# EAGLE design dev_A (EAGLE 9.5.1)
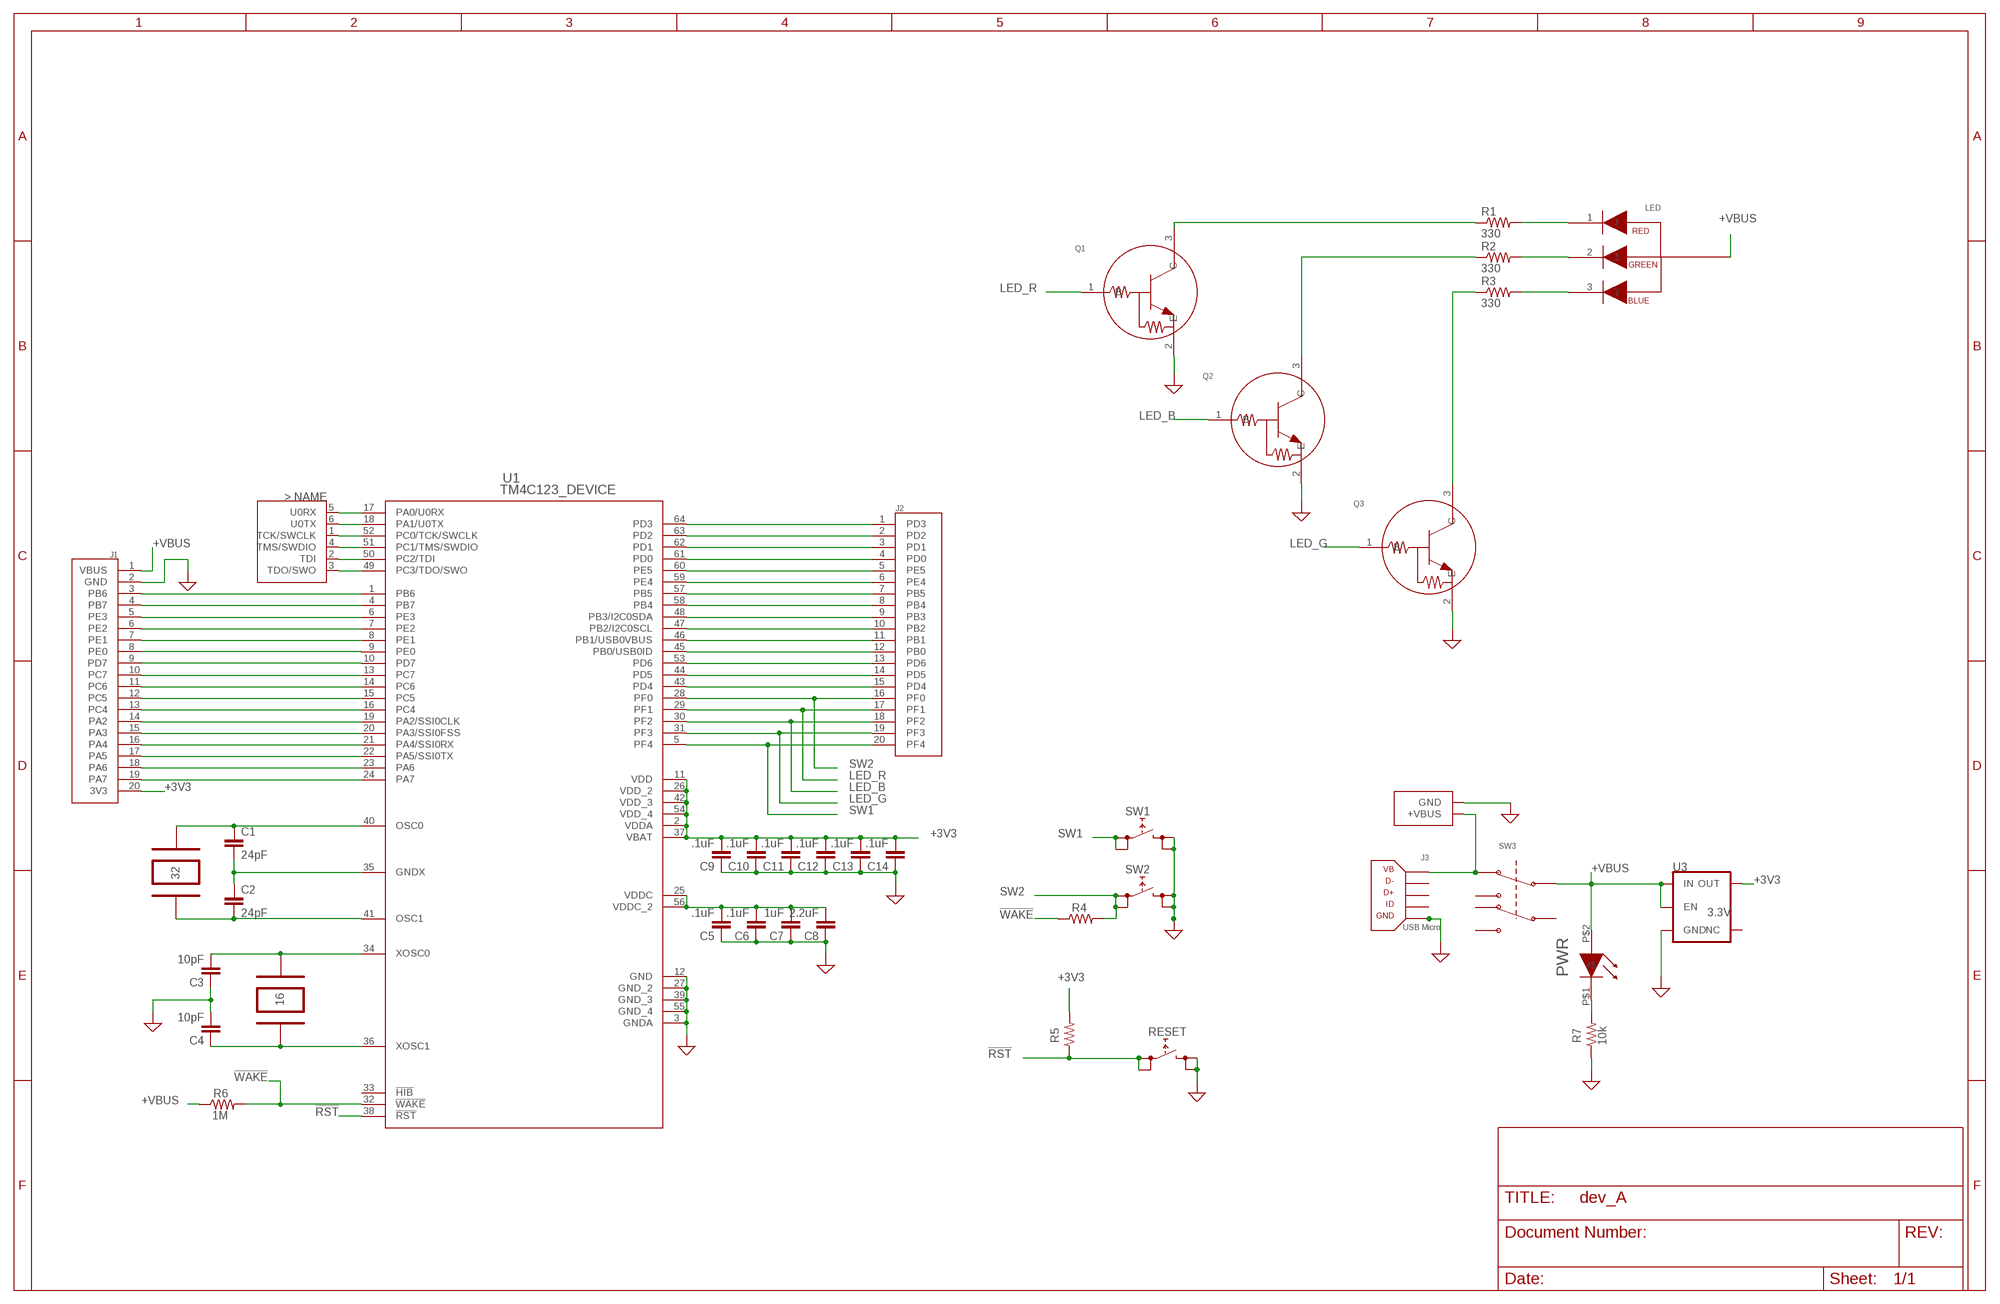
[diagram p0: schematic, sheet 1]

## Parts
C1  24pF  CAPACITOR  [CAPC1005X35N]
C2  24pF  CAPACITOR  [CAPC1005X35N]
C3  10pF  CAPACITOR  [CAPC1005X35N]
C4  10pF  CAPACITOR  [CAPC1005X35N]
C5  .1uF  CAPACITOR  [CAPC1005X35N]
C6  .1uF  CAPACITOR  [CAPC1005X35N]
C7  1uF  CAPACITOR  [CAPC1005X35N]
C8  2.2uF  CAPACITOR  [CAPC1005X35N]
C9  .1uF  CAPACITOR  [CAPC1005X35N]
C10  .1uF  CAPACITOR  [CAPC1005X35N]
C11  .1uF  CAPACITOR  [CAPC1005X35N]
C12  .1uF  CAPACITOR  [CAPC1005X35N]
C13  .1uF  CAPACITOR  [CAPC1005X35N]
C14  .1uF  CAPACITOR  [CAPC1005X35N]
DEBUG  JTAG  [HDRV6W64P254_2X3_800X508X838B]
J1  HEADER_J1  [HDRV20W80P254_1X20_5100X250X838B]
J2  HEADER_J2  [HDRV20W80P254_1X20_5100X250X838B]
J3  USBMICRO  [USBMICROB]
LED  RGBLED  [RGBLED]
PWR  LED_511  [LED_511]
Q1  NPN_BJT  [SOT416]
Q2  NPN_BJT  [SOT416]
Q3  NPN_BJT  [SOT416]
R1  330  RESISTOR  [CAPC1005X35N]
R2  330  RESISTOR  [CAPC1005X35N]
R3  330  RESISTOR  [CAPC1005X35N]
R4  RESISTOR  [CAPC1005X35N]
R5  RESISTOR  [CAPC1005X35N]
R6  1M  RESISTOR  [CAPC1005X35N]
R7  10k  RESISTOR  [CAPC1005X35N]
RESET  SWITCH_B3S  [SW_BS3]
SW1  SWITCH_B3S  [SW_BS3]
SW2  SWITCH_B3S  [SW_BS3]
SW3  JS202011SCQN  [SW_JS202011SCQN]
U1  TM4C123_DEVICE  [TM3C123_FOOTPRINT]
U3  3.3V  V_REG_AP2112K-3.3V  [SOT23-5]
VBUS  POWER  [HDRV2W64P254_1X2_600X300X838B]
Y1  32kHz  32KHZ_OSCILATOR  [GHI2_CRYSTAL_3.2X1.5]
Y2  Y2  16MHZ_OSCILLATOR  [CRYSTAL_16MHZ]

## Nets
!RST: R5.1 RESET.1 RESET.2 U1.38(!RST)
!WAKE: R4.1 R6.2 U1.32(!WAKE)
+3V3: C9.2 C10.2 C11.2 C12.2 C13.2 C14.2 J1.20(3V3) R5.2 U1.2(VDDA) U1.11(VDD) U1.26(VDD_2) U1.37(VBAT) U1.42(VDD_3) U1.54(VDD_4) U3.5(OUT)
+VBUS: J1.1(VBUS) LED.4 PWR.P$2 R6.1 SW3.2 U3.1(IN) U3.3(EN)
+VBUS_IN: J3.VB SW3.1 VBUS.1(+VBUS)
GND: C3.1 C4.2 C5.1 C6.1 C7.1 C8.1 C9.1 C10.1 C11.1 C12.1 C13.1 C14.1 J1.2(GND) J3.0(GND) J3.01(GND) J3.02(GND) J3.03(GND) J3.GND Q1.2(E) Q2.2(E) Q3.2(E) R7.1 RESET.3 RESET.4 SW1.3 SW1.4 SW2.3 SW2.4 U1.3(GNDA) U1.12(GND) U1.27(GND_2) U1.39(GND_3) U1.55(GND_4) U3.2(GND) VBUS.2(GND) ; supply symbol labelled SUP
LED_B: J2.18(PF2) Q2.1(B) U1.30(PF2)
LED_G: J2.19(PF3) Q3.1(B) U1.31(PF3)
LED_R: J2.17(PF1) Q1.1(B) U1.29(PF1)
N$3: J1.5(PE3) U1.6(PE3)
N$4: J1.6(PE2) U1.7(PE2)
N$5: J1.7(PE1) U1.8(PE1)
N$6: J1.8(PE0) U1.9(PE0)
N$7: J1.9(PD7) U1.10(PD7)
N$8: J1.10(PC7) U1.13(PC7)
N$9: J1.11(PC6) U1.14(PC6)
N$10: J1.12(PC5) U1.15(PC5)
N$11: J1.13(PC4) U1.16(PC4)
N$12: J1.14(PA2) U1.19(PA2/SSI0CLK)
N$13: J1.15(PA3) U1.20(PA3/SSI0FSS)
N$14: J1.16(PA4) U1.21(PA4/SSI0RX)
N$15: J1.17(PA5) U1.22(PA5/SSI0TX)
N$16: J1.18(PA6) U1.23(PA6)
N$17: J1.19(PA7) U1.24(PA7)
N$18: J2.15(PD4) U1.43(PD4)
N$19: J2.14(PD5) U1.44(PD5)
N$20: J2.13(PD6) U1.53(PD6)
N$21: J2.12(PB0) U1.45(PB0/USB0ID)
N$22: J2.11(PB1) U1.46(PB1/USB0VBUS)
N$23: J2.10(PB2) U1.47(PB2/I2C0SCL)
N$24: J2.9(PB3) U1.48(PB3/I2C0SDA)
N$25: J2.8(PB4) U1.58(PB4)
N$26: J2.7(PB5) U1.57(PB5)
N$27: J2.6(PE4) U1.59(PE4)
N$28: J2.5(PE5) U1.60(PE5)
N$29: J2.4(PD0) U1.61(PD0)
N$30: J2.3(PD1) U1.62(PD1)
N$31: PWR.P$1 R7.2
N$32: LED.1 R1.2
N$33: LED.2 R2.2
N$34: LED.3 R3.2
N$35: Q3.3(C) R3.1
N$36: Q2.3(C) R2.1
N$37: Q1.3(C) R1.1
N$38: C1.1 U1.40(OSC0) Y1.P$2
N$39: C2.2 U1.41(OSC1) Y1.P$1
N$40: C1.2 C2.1 U1.35(GNDX)
N$41: C3.2 U1.34(XOSC0) Y2.2
N$42: C4.1 U1.36(XOSC1) Y2.1
N$43: DEBUG.5(U0RX) U1.17(PA0/U0RX)
N$45: DEBUG.6(U0TX) U1.18(PA1/U0TX)
N$46: DEBUG.1(TCK/SWCLK) U1.52(PC0/TCK/SWCLK)
N$47: DEBUG.4(TMS/SWDIO) U1.51(PC1/TMS/SWDIO)
N$48: DEBUG.2(TDI) U1.50(PC2/TDI)
N$49: DEBUG.3(TDO/SWO) U1.49(PC3/TDO/SWO)
N$50: J2.2(PD2) U1.63(PD2)
N$51: J2.1(PD3) U1.64(PD3)
PB6: J1.3(PB6) U1.1(PB6)
PB7: J1.4(PB7) U1.4(PB7)
SW1: J2.20(PF4) SW1.1 SW1.2 U1.5(PF4)
SW2: J2.16(PF0) R4.2 SW2.1 SW2.2 U1.28(PF0)
VDDC: C5.2 C6.2 C7.2 C8.2 U1.25(VDDC) U1.56(VDDC_2)
Unconnected: J3.D+ J3.D- J3.ID SW3.3 SW3.4 SW3.5 SW3.6 U1.33(!HIB) U3.4(NC)

## Library data of the parts
C1-C14 = MICROCONTROLLER:CAPACITOR
DEBUG = MICROCONTROLLER:JTAG
J1 = MICROCONTROLLER:HEADER_J1
J2 = MICROCONTROLLER:HEADER_J2
J3 = MICROCONTROLLER:USBMICRO
LED = MICROCONTROLLER:RGBLED
PWR = MICROCONTROLLER:LED_511
Q1-Q3 = MICROCONTROLLER:NPN_BJT
R1-R7 = MICROCONTROLLER:RESISTOR
RESET SW1 SW2 = MICROCONTROLLER:SWITCH_B3S
SW3 = MICROCONTROLLER:JS202011SCQN; MANUFACTURER_PART_NUMBER: JS202011SCQN; VENDOR: C&K
U1 = MICROCONTROLLER:TM4C123_DEVICE
U3 = SparkFun-IC-Power:V_REG_AP2112: AP2112 - 600mA CMOS LDO Regulator w/ Enable The AP2112 is CMOS process low dropout linear regulator with enable function, the regulator delivers a guaranteed 600mA (min.) continuous load current. Features Output Voltage Accuracy: ±1.5% Output Current: 600mA (Min.) Foldback Short Current Protection: 50mA Enable Function to Turn ON/OFF VOUT Low Dropout Voltage (3.3V): 250mV (Typ.) @IOUT=600mA Excellent Load Regulation: 0.2%/A (Typ.) Excellent Line Regulation: 0.02%/V (Typ.) Low Quiescent Current: 55μA (Typ.) Low Standby Current: 0.01μA (Typ.) Low Output Noise: 50μVRMS PSRR: 100Hz -65dB, 1kHz -65dB OTSD Protection Stable with 1.0μF Flexible Cap: Ceramic, Tantalum and Aluminum Electrolytic Operation Temperature Range: -40°C to 85°C ESD: MM 400V, HBM 4000V; PROD_ID: VREG-12457
VBUS = MICROCONTROLLER:POWER
Y1 = MICROCONTROLLER:32KHZ_OSCILATOR
Y2 = MICROCONTROLLER:16MHZ_OSCILLATOR

## Board
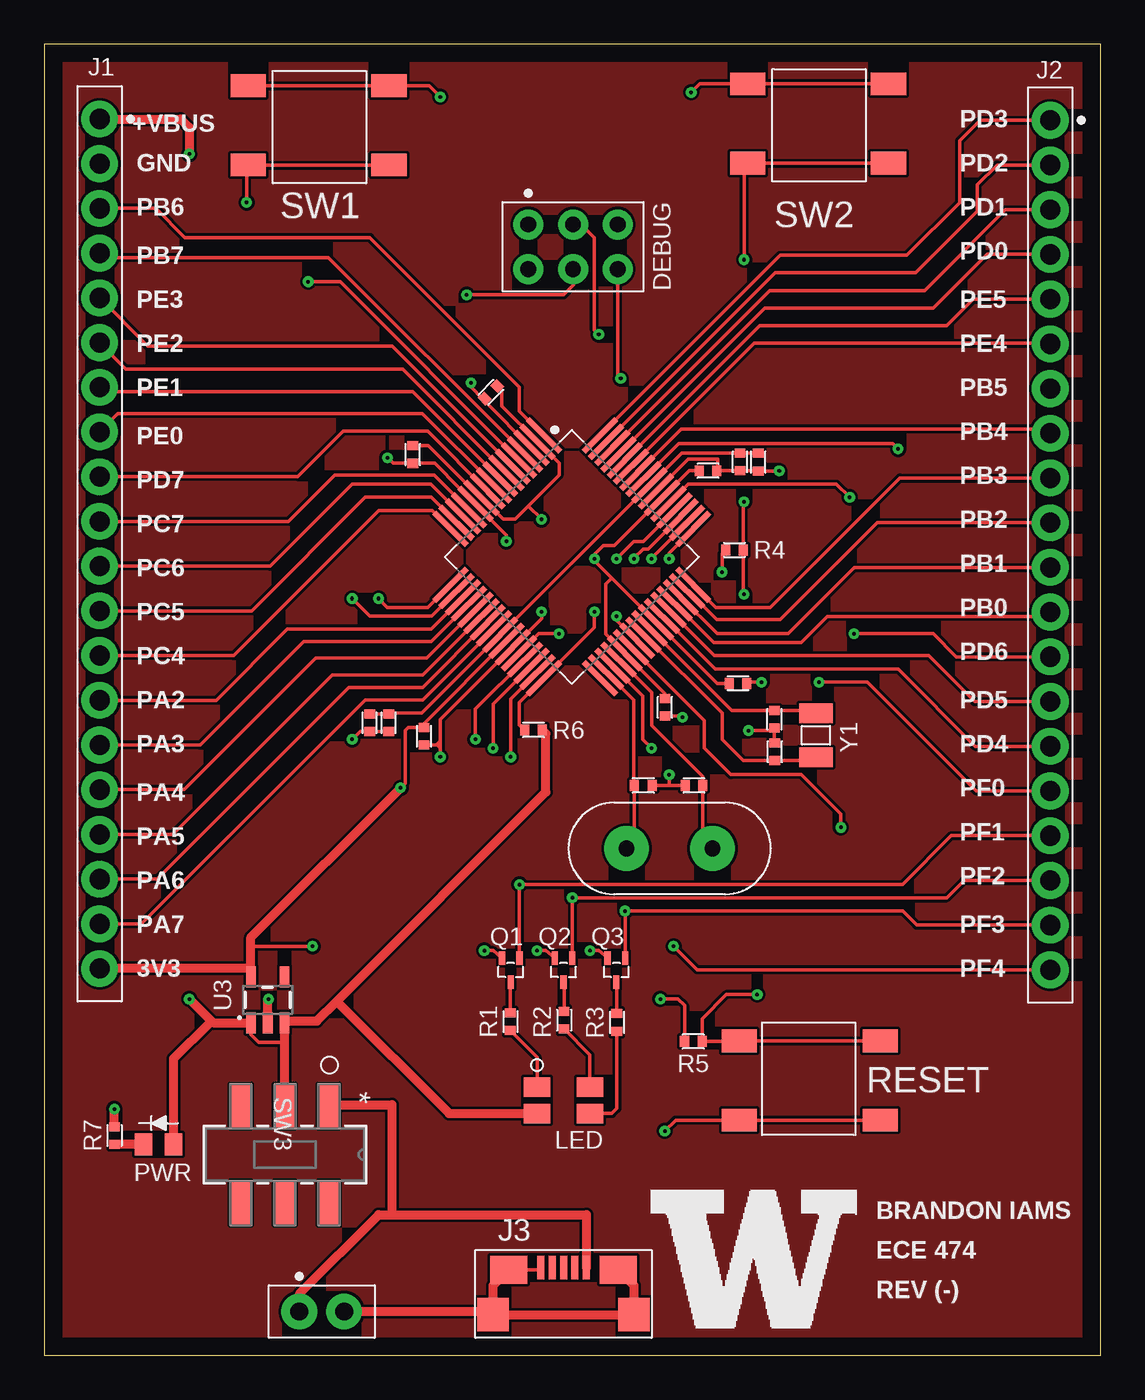
[diagram p1: board, top side]
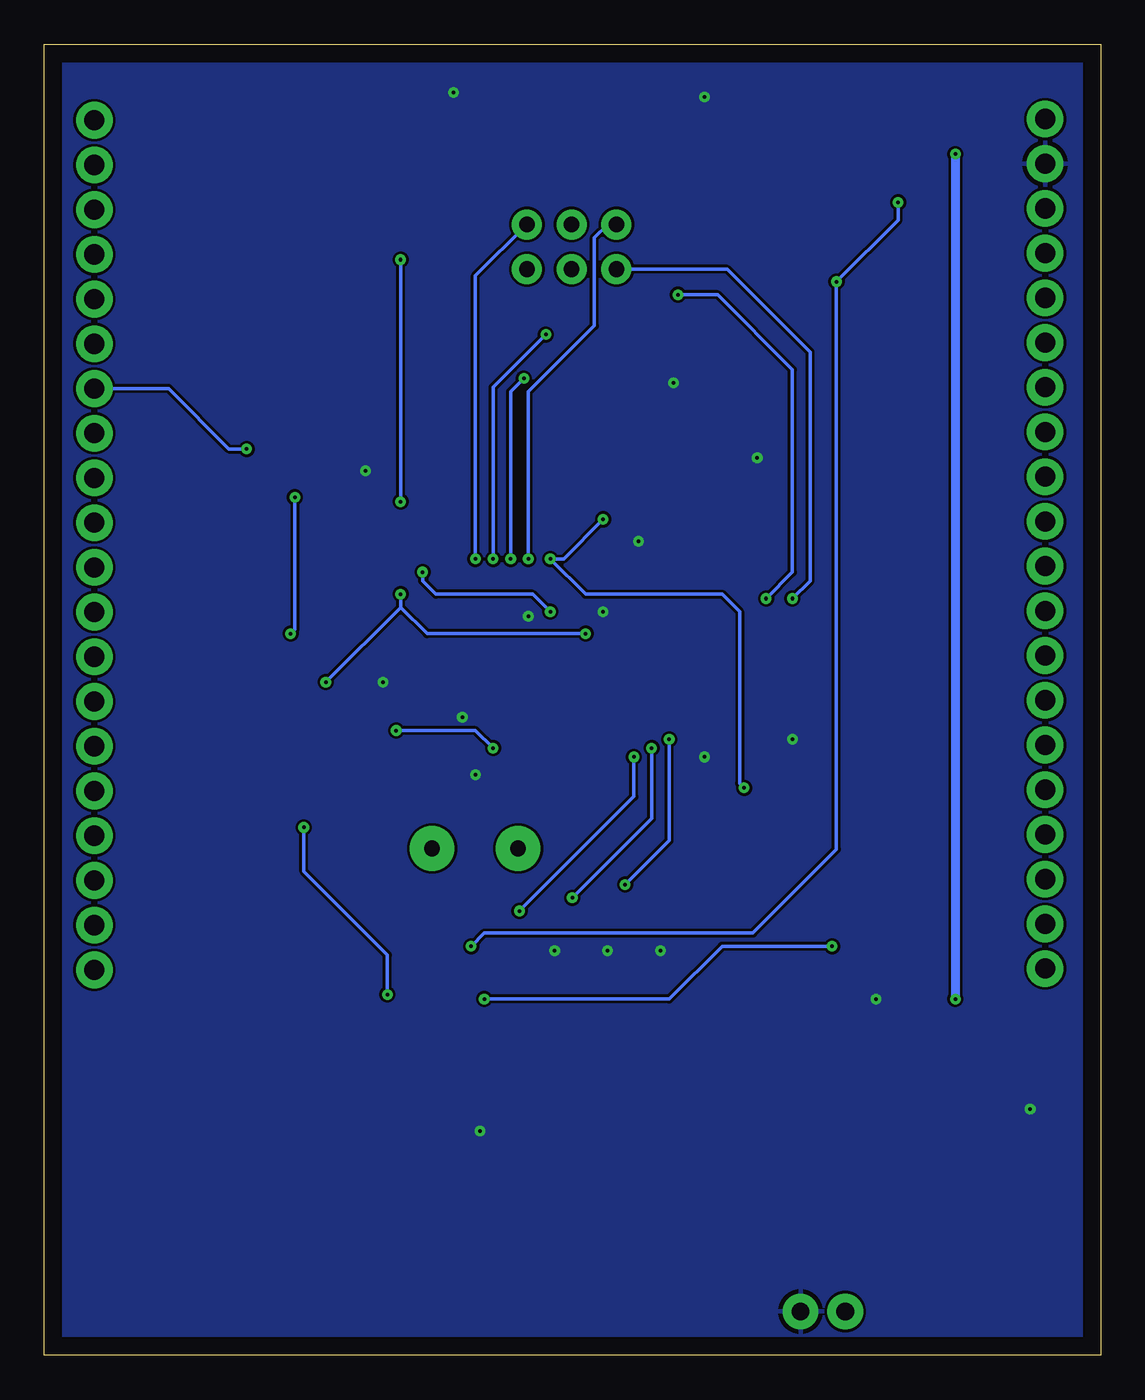
[diagram p2: board, bottom side, seen from below]

Size 60 x 74.5 mm. Coordinates in mm from the lower left corner, seen from the top.
Outline: 0,0 60,0 60,74.5 0,74.5 0,0
Copper layers (1*16): Top 0.035mm / dielectric 1.5mm / Bottom 0.035mm
Design rules "default *": minimum track width 3.5mil, minimum drill 0.2mm, track to track 6mil, track to pad 6mil, pad to pad 6mil, via to via 6mil, smd to smd 6mil, copper to edge 40mil, drill to drill 6mil, minimum pad ring 10mil, minimum via ring 8mil, stop-mask expansion 4mil, vias tented up to drill 0.21mm, thermal gap 10mil

### Footprints (pad centres in the part's own frame; a part is rotated, then mirrored left to right if it is on the bottom)
CAPC1005X35N = smd 0.512 x 0.612: 1 -0.5,0; 2 0.5,0
HDRV6W64P254_2X3_800X508X838B = drill 0.889 pad 1.705: 1 0,0; 2 2.54,0; 3 5.08,0; 4 5.08,-2.54; 5 2.54,-2.54; 6 0,-2.54
HDRV20W80P254_1X20_5100X250X838B = drill 1.143 pad 2.083: 1 0,0; 2 2.54,0; 3 5.08,0; 4 7.62,0; 5 10.16,0; 6 12.7,0; 7 15.24,0; 8 17.78,0; 9 20.32,0; 10 22.86,0; 11 25.4,0; 12 27.94,0; 13 30.48,0; 14 33.02,0; 15 35.56,0; 16 38.1,0; 17 40.64,0; 18 43.18,0; 19 45.72,0; 20 48.26,0
USBMICROB = smd 1.8 x 1.9: 0 -4,-2.675; 03 4,-2.675 | smd 2.1 x 1.6: 01 -3.1,-0.125; 02 3.1,-0.125 | smd 0.4 x 1.35: D+ 0,0; D- 0.65,0; GND -1.3,0; ID -0.65,0; VB 1.3,0
RGBLED = smd 1.1 x 1.5: 1 -0.75,-1.5; 2 -0.75,1.5; 3 0.75,1.5; 4 0.75,-1.5
LED_511 = smd 1 x 1.25: P$1 -0.85,0; P$2 0.85,0
SOT416 = smd 0.356 x 0.762: 1 0,-0.076; 2 1,-0.076; 3 0.5,1.295
SW_BS3 = smd 2 x 1.3: 1 4,-2.25; 2 -4,-2.25; 3 4,2.25; 4 -4,2.25
SW_JS202011SCQN = smd 2.489 x 1.194: 1 -2.756,2.5; 2 -2.756,0; 3 -2.756,-2.5; 4 2.756,-2.5; 5 2.756,0; 6 2.756,2.5
TM3C123_FOOTPRINT = smd 2.6 x 0.322: 1 -6,3.75; 2 -6,3.25; 3 -6,2.75; 4 -6,2.25; 5 -6,1.75; 6 -6,1.25; 7 -6,0.75; 8 -6,0.25; 9 -6,-0.25; 10 -6,-0.75; 11 -6,-1.25; 12 -6,-1.75; 13 -6,-2.25; 14 -6,-2.75; 15 -6,-3.25; 16 -6,-3.75; 33 6,-3.75; 34 6,-3.25; 35 6,-2.75; 36 6,-2.25; 37 6,-1.75; 38 6,-1.25; 39 6,-0.75; 40 6,-0.25; 41 6,0.25; 42 6,0.75; 43 6,1.25; 44 6,1.75; 45 6,2.25; 46 6,2.75; 47 6,3.25; 48 6,3.75 | smd 0.322 x 2.6: 17 -3.75,-6; 18 -3.25,-6; 19 -2.75,-6; 20 -2.25,-6; 21 -1.75,-6; 22 -1.25,-6; 23 -0.75,-6; 24 -0.25,-6; 25 0.25,-6; 26 0.75,-6; 27 1.25,-6; 28 1.75,-6; 29 2.25,-6; 30 2.75,-6; 31 3.25,-6; 32 3.75,-6; 49 3.75,6; 50 3.25,6; 51 2.75,6; 52 2.25,6; 53 1.75,6; 54 1.25,6; 55 0.75,6; 56 0.25,6; 57 -0.25,6; 58 -0.75,6; 59 -1.25,6; 60 -1.75,6; 61 -2.25,6; 62 -2.75,6; 63 -3.25,6; 64 -3.75,6
SOT23-5 = smd 0.55 x 1.2: 1 -0.95,-1.3; 2 0,-1.3; 3 0.95,-1.3; 4 0.95,1.3; 5 -0.95,1.3
HDRV2W64P254_1X2_600X300X838B = drill 1.016 pad 2.032: 1 0,0; 2 2.54,0
GHI2_CRYSTAL_3.2X1.5 = smd 1.1 x 1.9: P$1 -1.25,0; P$2 1.25,0
CRYSTAL_16MHZ = drill 0.889 pad 2.54: 1 -2.44,0; 2 2.44,0

### Placement (x,y rotation side)
C1  41.5,34.3 90 top
C2  41.48,36.15 90 top
C3  34.03,32.38 180 top
C4  36.91,32.38 180 top
C5  18.49,35.95 90 top
C6  39.52,50.76 90 top
C7  19.57,35.95 90 top
C8  40.56,50.75 90 top
C9  37.71,50.26 180 top
C10  39.4,38.18 180 top
C11  21.58,35.18 90 top
C12  20.94,51.18 90 top
C13  35.26,36.82 90 top
C14  25.38,54.72 45 top
DEBUG  27.5,64.25 0 top
J1  3.15,70.24 270 top
J2  57.14,70.17 270 top
J3  29.5,5 0 top
LED  29.5,14.5 270 top
PWR  6.5,12 0 top
Q1  27,22.5 180 top
Q2  30,22.5 180 top
Q3  33,22.5 180 top
R1  26.48,18.96 270 top
R2  29.53,19.04 270 top
R3  32.53,18.92 270 top
R4  39.21,45.76 0 top
R5  36.87,17.84 180 top
R6  27.79,35.53 180 top
R7  4,12.5 270 top
RESET  43.48,15.62 180 top
SW1  15.59,69.88 0 top
SW2  43.96,69.98 0 top
SW3  13.68,11.41 270 top
U1  29.97,45.37 315 top
U3  12.7,20.2 0 top
U$1  LOGO  [LOGO]  34.5,1 0 top
VBUS  14.5,2.5 0 top
Y1  43.83,35.24 270 top
Y2  35.52,28.8 180 top

### Tracks (layer width: path | path; a pad name or v marks a point on that pad's centre or on a via)
!RST  (via drill 0.2)
  Top 0.2: U1.38 37.5,36.07 37.5,34.5 39,33 43,33 45.25,30.75 v45.25,30 | v40.5,20.5 38.75,20.5 37.37,19.12 R5.1 39.48,17.84 RESET.1 | RESET.1 RESET.2 | RESET.1 39.85,17.5
  Bottom 0.2: v40.5,20.5 40.5,22.75 45.25,27.5 v45.25,30
!WAKE  (via drill 0.2)
  Top 0.2: R6.2 27,35.82 27,37.09 U1.32 31.25,41.34 v31.25,42.25 | v38.5,44.5 38.5,45.55 R4.1
  Bottom 0.2: v31.25,42.25 32.25,43.25 37.75,43.25 38.5,44 v38.5,44.5
+3V3  (via drill 0.2)
  Top 0.2: U1.26 21.58,35.91 C11.2 20.68,35.68 20.5,35.5 20.5,32.5 v20.25,32.25 | C13.2 35.26,37.6 U1.37 31.89,40.98 31.89,43.83 32.23,44.17 | C14.2 26,54.81 26,53.94 U1.2 29.25,50.69 29.25,50 27.5,48.25 | U3.5 11.75,22 | C12.2 21.82,51.68 23.79,49.71 23.81,49.71 24.79,48.73 U1.11 26.07,47.5 26.75,47.5 27.5,48.25 | C10.2 38.22,38.18 U1.42 32.23,44.17 | v15.25,23.25 11.75,23.25 | v35,20.25 36,20.25 36.37,19.88 R5.2 | C9.2 36.63,50.26 U1.54 32.37,46 31.75,46 31.25,45.5 v31.25,45.25 31.25,45.15 32.23,44.17 | v28.25,47.5 27.5,48.25
  Top 0.5: 11.75,22 3.17,22 J1.20 | U3.5 11.75,23.25 11.75,23.75 v20.25,32.25
  Bottom 0.2: v15.25,23.25 21.5,23.25 24.5,20.25 v35,20.25 | v28.25,47.5 30.5,45.25 v31.25,45.25 29.25,43.25 21.5,43.25 20.5,42.25 20.5,32.5 v20.25,32.25
+VBUS  (via drill 0.2)
  Top 0.2: 13.65,17.8 U3.3 13.75,19 | 13.65,17.8 13.65,15.95 | 13.65,17.8 12.2,17.8 11.75,18.25 U3.1 9.4,18.9
  Top 0.5: PWR.P$2 7.35,16.85 9.4,18.9 | R6.1 28.5,35.32 28.5,32 16.62,20.12 | 13.75,19 15.5,19 16.62,20.12 | J1.1 7.76,70.24 8.25,69.75 v8.25,68.25 | v8.25,20.25 9.6,18.9 U3.1 | U3.3 13.65,15.95 13.65,14.2 SW3.2 | LED.4 23,13.75 16.62,20.12
  Bottom 0.5: v8.25,68.25 v8.25,20.25
+VBUS_IN
  Top 0.2: SW3.1 16.26,14.25
  Top 0.5: 16.26,14.25 19.75,14.25 19.75,8 | VBUS.1 14.5,3.5 19,8 19.75,8 | J3.VB 30.8,8 19.75,8
GND  (via drill 0.2)
  Top 0.2: C3.1 35.5,32.38 | 35.5,32.38 C4.2 | 22.28,34.68 C11.1 | 20.92,50.7 C12.1 | 22.5,34.9 22.5,36.13 U1.27 28.25,41.88 v28.25,42.25 | 22.5,34.9 22.5,34.5 | 22.5,34.5 v22.5,34 | 22.28,34.68 22.32,34.68 22.5,34.5 | 22.28,34.68 22.5,34.9 | U1.3 25.03,54.2 C14.1 24.88,54.37 24.25,55 v24.25,55.25 | C12.1 22.18,50.68 23.61,49.26 U1.12 26.25,46.62 v26.25,46.25 | SW2.3 SW2.4 37.23,72.23 v36.75,71.75 | RESET.4 RESET.3 35.87,13.37 v35.25,12.75 | U1.55 36.57,50.91 38.25,50.91 38.25,50.3 C9.1 C6.1 C8.1 v41.75,50.25 | C12.1 19.82,50.68 v19.5,51 | C7.1 C5.1 17.95,35.45 v17.5,35 | U1.39 32.5,41.78 v32.5,42 | SW1.4 SW1.3 21.87,72.13 v22.5,71.5 | Q1.2 25.5,23 v25,23 | Q2.2 28.5,23 v28,23 | Q3.2 31.5,23 v31,23 | C13.1 36.18,36.32 v36.25,36.25 | C10.1 39.97,38.25 v40.75,38.25 | 35.5,32.38 v35.5,33 | J3.GND 28.07,4.88 J3.01
  Top 0.5: U3.2 12.7,20.2 v12.75,20.25 | R7.1 v4,14 | VBUS.2 25.5,2.5 J3.0 | J3.0 25.5,3.98 J3.01 | J3.02 33.5,3.98 J3.03 J3.0
  pour Bottom: 0,74.5 60,74.5 60,0 0,0 0,1.25
LED_B  (via drill 0.2)
  Top 0.2: U1.30 25.5,37.01 v25.5,34.5 | J2.18 57.13,27 52.25,27 51.25,26 v30,26 Q2.1
  Bottom 0.2: v30,26 25.5,30.5 v25.5,34.5
LED_G  (via drill 0.2)
  Top 0.2: U1.31 26.5,37.3 v26.5,34 | J2.19 49.55,24.45 48.75,25.25 v33,25.25 Q3.1
  Bottom 0.2: v33,25.25 26.5,31.75 v26.5,34
LED_R  (via drill 0.2)
  Top 0.2: U1.29 24.5,36.71 v24.5,35 | J2.17 51.53,29.53 48.75,26.75 v27,26.75 Q1.1
  Bottom 0.2: v27,26.75 24.5,29.25 v24.5,35
N$3
  Top 0.2: U1.6 19.78,57.33 5.9,57.33 J1.5
N$4
  Top 0.2: U1.7 20.36,56.04 4.65,56.04 J1.6
N$5
  Top 0.2: U1.8 20.94,54.75 3.4,54.75 J1.7
N$6
  Top 0.2: U1.9 21.49,53.5 4.19,53.5 J1.8
N$7
  Top 0.2: U1.10 21.78,52.5 17,52.5 14.42,49.92 J1.9
N$8
  Top 0.2: U1.13 22.16,50 16.5,50 13.88,47.38 J1.10
N$9
  Top 0.2: U1.14 21.95,49.5 17.5,49.5 12.84,44.84 J1.11
N$10
  Top 0.2: U1.15 21.99,48.75 18.25,48.75 11.8,42.3 J1.12
N$11
  Top 0.2: U1.16 22.04,48 19,48 10.76,39.76 J1.13
N$12
  Top 0.2: U1.19 21.98,41.26 13.81,41.26 9.77,37.22 J1.14
N$13
  Top 0.2: U1.20 21.98,40.56 14.75,40.56 8.87,34.68 J1.15
N$14
  Top 0.2: U1.21 21.74,39.61 15.44,39.61 7.97,32.14 J1.16
N$15
  Top 0.2: U1.22 21.49,38.66 16.38,38.66 7.32,29.6 J1.17
N$16
  Top 0.2: U1.23 21.5,37.95 17.31,37.95 6.42,27.06 J1.18
N$17
  Top 0.2: U1.24 21.5,37.25 18.25,37.25 5.52,24.52 J1.19
N$18
  Top 0.2: U1.43 38.11,39 48.5,39 52.89,34.61 J2.15
N$19
  Top 0.2: U1.44 38.06,39.75 50.25,39.75 52.85,37.15 J2.14
N$20  (via drill 0.2)
  Top 0.2: J2.13 51.81,39.69 50.5,41 v46,41 | U1.53 36.58,49.5 45,49.5 v45.75,48.75
  Bottom 0.2: v46,41 45.75,41.25 v45.75,48.75
N$21
  Top 0.2: U1.45 38.02,40.5 43,40.5 44.48,41.98 56.89,41.98 J2.12
N$22
  Top 0.2: U1.46 38.23,41 42.25,41 46.02,44.77 J2.11
N$23
  Top 0.2: U1.47 36.56,43.42 38.19,41.8 41.8,41.8 47.31,47.31 J2.10
N$24
  Top 0.2: U1.48 38.14,42.5 41.25,42.5 48.6,49.85 J2.9
N$25
  Top 0.2: U1.58 36.18,52.64 56.89,52.64 J2.8
N$26  (via drill 0.2)
  Top 0.2: U1.57 36.05,51.8 48.2,51.8 v48.5,51.5
  Bottom 0.2: v48.5,51.5 49.5,51.5 52.93,54.93 J2.7
N$27
  Top 0.2: U1.59 40.34,57.5 57.11,57.5 J2.6
N$28
  Top 0.2: U1.60 40.63,58.5 51.25,58.5 52.76,60.01 J2.5
N$29
  Top 0.2: U1.61 40.92,59.5 50.5,59.5 53.55,62.55 J2.4
N$30
  Top 0.2: U1.62 41.22,60.5 50,60.5 54.59,65.09 J2.3
N$31
  Top 0.5: PWR.P$1 R7.2
N$32
  Top 0.2: R1.2 28,16.94 LED.1
N$33
  Top 0.2: R2.2 31,17.07 LED.2
N$34
  Top 0.2: R3.2 32.53,14.03 32.25,13.75 LED.3
N$35
  Top 0.2: Q3.3 32.53,21.18 R3.1
N$36
  Top 0.2: Q2.3 29.53,21.18 R2.1
N$37
  Top 0.2: R1.1 26.48,21.18 Q1.3
N$38
  Top 0.2: U1.40 38.5,36.49 38.5,35 39.7,33.8 C1.1 43.64,33.8 Y1.P$2
N$39
  Top 0.2: U1.41 39.04,36.65 C2.2 43.67,36.65 Y1.P$1
N$40  (via drill 0.2)
  Top 0.2: C1.2 41.48,34.82 C2.1 41.33,35.5 v40,35.5 | U1.35 34,37.45 34,35 v34.5,34.5
  Bottom 0.2: v34.5,34.5 35.5,35.5 v40,35.5
N$41
  Top 0.2: U1.34 33.5,37.24 33.5,32.41 C3.2 33.53,29.25 Y2.2
N$42
  Top 0.2: U1.36 34.5,37.66 34.5,35.79 37.41,32.88 C4.1 37.41,29.36 Y2.1
N$43  (via drill 0.2)
  Top 0.2: v19,43 19.5,42.5 21.8,42.5 U1.17 | v24,60.25 29.5,60.25 30.04,60.79 DEBUG.5
  Bottom 0.2: v19,43 17.5,44.5 17.5,56 21.75,60.25 v24,60.25
N$45  (via drill 0.2)
  Top 0.2: U1.18 22.01,42 18.5,42 v17.5,43
  Bottom 0.2: v17.5,43 16.5,44 16.5,57 21.21,61.71 DEBUG.6
N$46  (via drill 0.2)
  Top 0.2: U1.52 34.04,46.25 33.5,46.25 v32.5,45.25
  Bottom 0.2: v32.5,45.25 32.5,54.75 28.75,58.5 28.75,63.5 28,64.25 DEBUG.1
N$47  (via drill 0.2)
  Top 0.2: U1.51 34.3,45.81 34.02,45.81 33.5,45.29 v33.5,45.25 | v32.75,55.5 32.58,55.67 DEBUG.4
  Bottom 0.2: v33.5,45.25 33.5,54.75 v32.75,55.5
N$48  (via drill 0.2)
  Top 0.2: U1.50 34.5,45.3 v34.5,45.25 | v31.5,58 31.25,58.25 31.25,63.5 30.5,64.25 DEBUG.2
  Bottom 0.2: v34.5,45.25 34.5,55 v31.5,58
N$49  (via drill 0.2)
  Top 0.2: U1.49 35.5,45.59 v35.5,45.25
  Bottom 0.2: DEBUG.3 35.5,61.33 v35.5,45.25
N$50
  Top 0.2: U1.63 41.51,61.5 49.5,61.5 53,65 53,66.5 54.13,67.63 J2.2
N$51
  Top 0.2: U1.64 41.8,62.5 49,62.5 52,65.5 52,69 53.17,70.17 J2.1
PB6
  Top 0.2: J1.3 6.34,65.16 8,63.5 18.5,63.5 27,55 27,53.64 U1.1
PB7
  Top 0.2: U1.4 16.15,62.37 3.4,62.37 J1.4
SW1  (via drill 0.2)
  Top 0.2: U1.5 16.82,61 v15,61 | v11.5,65.5 11.5,67.54 SW1.2 SW1.1 | J2.20 37.09,21.91 v35.75,23.25
  Bottom 0.2: v11.5,65.5 11.5,64.5 v15,61 15,28.75 19.75,24 35,24 v35.75,23.25
SW2  (via drill 0.2)
  Top 0.2: J2.16 52.93,32.07 46.75,38.25 v44,38.25 | U1.28 28.08,41 v29.25,41 | v39.75,43.25 39.71,43.29 R4.2 39.71,48.46 v39.75,48.5 | v39.75,62.25 39.75,67.52 SW2.2 SW2.1
  Bottom 0.2: v29.25,41 38.25,41 39.75,42.5 | 39.75,42.5 v44,38.25 | 39.75,42.5 v39.75,43.25 | v39.75,48.5 v39.75,62.25
TOP
  pour Top: 0,74.5 60,74.5 60,69 60,0 54.25,0 0,0 0,0.25
VDDC
  Top 0.2: C8.2 C6.2 36.22,51.26 U1.56 U1.25 21.46,36.5 19.62,36.5 C7.2 C5.2

### Text on the board
tNames: +VBUS | PD3 | GND | PD2 | PB6 | PD1 | PB7 | PD0 | PE3 | PE5 | PE2 | PE4 | PE1 | PB5 | PE0 | PB4 | PB3 | PD7 | PC7 | PB2 | PC6 | PB1 | PC5 | PB0 | PD6 | PC4 | PA2 | PD5 | PA3 | PD4 | PA4 | PF0 | PA5 | PF1 | PF2 | PA6 | PA7 | PF3 | 3V3 | PF4 | BRANDON IAMS | ECE 474 | REV (-)